# EAGLE design Alti (EAGLE 9.4.2)
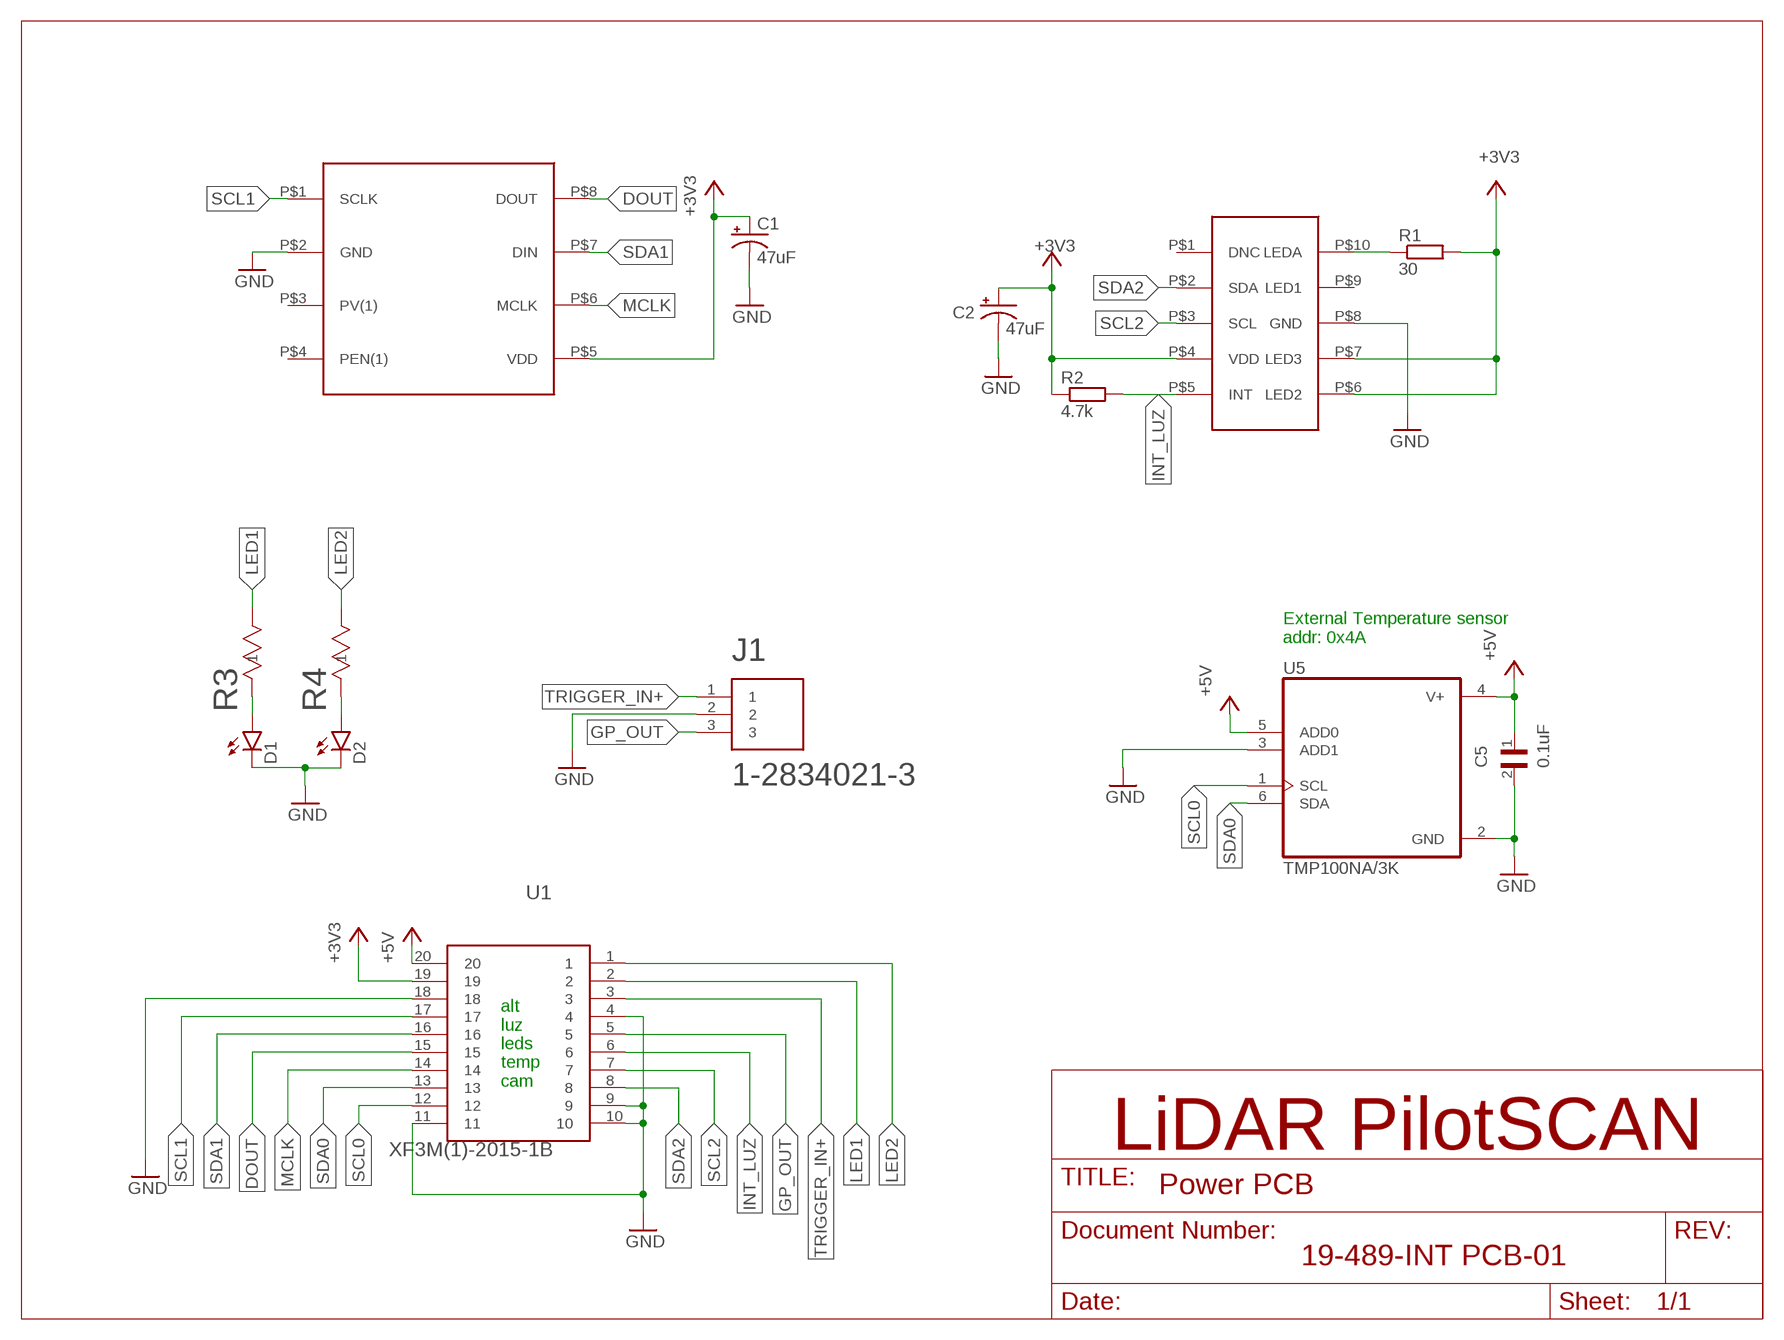
[diagram p0: schematic, sheet 1]

## Parts
C1  47uF  CL31A476MQHNNWE  [CL31A476MQHNNWE]
C2  47uF  CL31A476MQHNNWE  [CL31A476MQHNNWE]
C5  0.1uF  08056C104JAZ2A  [CAPC2012X140N]
D1  TLMS1000-GS08  [RESC1608X55]
D2  TLMS1000-GS08  [RESC1608X55]
J1  1-2834021-3  [CONN_1-2834021-3]
R1  30  R-EU_1812X7R  [1812X7R]
R2  4.7k  RMCF0805FT4K70  [RMCF0805FT4K70]
R3  RC0201JR-071K8L  [RES_RC0201_P6XP3]
R4  RC0201JR-071K8L  [RES_RC0201_P6XP3]
U1  XF3M(1)-2015-1B  [XF3M(1)-2015-1B]
U2  325540009-50  [325540009-50]
U3  SI1147-M01-GM  [SI1147-M01-GM]
U5  TMP100NA/3K  [TMP100NA/3K]

## Nets
+3V3: C1.2(+) C2.2(+) R1.2 R2.1 U1.19 U2.P$5(VDD) U3.P$4(VDD) U3.P$6(LED2) U3.P$7(LED3)
+5V [power]: C5.1 U1.20 U5.4(V+) U5.5(ADD0)
DOUT: U1.15 U2.P$8(DOUT)
GND: C1.1(-) C2.1(-) C5.2 D1.2(C) D2.2(C) J1.2 U1.4 U1.9 U1.10 U1.11 U1.18 U2.P$2(GND) U3.P$8(GND) U5.2(GND) U5.3(ADD1)
GP_OUT: J1.3 U1.5
INT_LUZ: R2.2 U1.6 U3.P$5(INT)
LED1: R3.2 U1.2
LED2: R4.2 U1.1
MCLK: U1.14 U2.P$6(MCLK)
N$1: D1.1(A) R3.1
N$2: D2.1(A) R4.1
N$10: R1.1 U3.P$10(LEDA)
SCL0: U1.12 U5.1(SCL)
SCL1: U1.17 U2.P$1(SCLK)
SCL2: U1.7 U3.P$3(SCL)
SDA0: U1.13 U5.6(SDA)
SDA1: U1.16 U2.P$7(DIN)
SDA2: U1.8 U3.P$2(SDA)
TRIGGER_IN+: J1.1 U1.3
Unconnected: U2.P$3(PV(1)) U2.P$4(PEN(1)) U3.P$1(DNC) U3.P$9(LED1)

## Notes on the sheet
- External Temperature sensor
  addr: 0x4A
- alt
  luz
  leds
  temp
  cam

## Library data of the parts
C1 C2 = CL31A476MQHNNWE:CL31A476MQHNNWE
C5 = 08056C104JAZ2A:08056C104JAZ2A: Cap Ceramic 0.1uF 6.3V X7R 5% SMD 0805 FlexiTerm 125°C T/R; AVAILABILITY: Unavailable; DESCRIPTION: 0805 100 nF 6.3 V ±5 % Tolerance X7R SMT Multilayer Ceramic Capacitor; MF: AVX; MP: 08056C104JAZ2A; PACKAGE: 0805 AVX; PRICE: None
D1 D2 = TLMS1000-GS08:TLMS1000-GS08: LED Uni-Color Red 640nm 2-Pin SMD T/R; DESCRIPTION: LED Uni-Color Red 640nm Automotive 2-Pin Chip 0603 T/R; DIGI-KEY_PART_NUMBER: TLMS1000-GS08CT-ND; DIGI-KEY_PURCHASE_URL: https://www.digikey.com.co/product-detail/en/vishay-semiconductor-opto-division/TLMS1000-GS08/TLMS1000-GS08CT-ND/4743829?utm_source=snapeda&utm_medium=aggregator&utm_campaign=symbol; MF: Vishay; MP: TLMS1000-GS08; PACKAGE: 0603 Vishay
J1 = 1-2834021-3:1-2834021-3: Conn PC Terminal Block RCP 3 POS 2.5mm Solder ST Thru-Hole 5A/Contact Box/Carton; COMMENT: 1-2834021-3; DESCRIPTION: Conn PC Terminal Block RCP 3 POS 2.5mm Solder ST Thru-Hole 5A/Contact Box/Carton; DIGI-KEY_PART_NUMBER: A123845-ND; DIGI-KEY_PURCHASE_URL: https://www.digikey.com/product-detail/en/te-connectivity-amp-connectors/1-2834021-3/A123845-ND/5872961?utm_source=snapeda&utm_medium=aggregator&utm_campaign=symbol; MF: TE Connectivity; MP: 1-2834021-3; PACKAGE: None; TE_PURCHASE_URL: https://www.te.com/usa-en/product-1-2834021-3.html?te_bu=Cor&te_type=disp&te_campaign=seda_glo_cor-seda-global-disp-prtnr-fy19-seda-model-bom-cta_sma-317_1&elqCampaignId=32493
R1 = resistor:R-EU_: RESISTOR, European symbol
R2 = RMCF0805FT4K70:RMCF0805FT4K70
R3 R4 = RES_SMD_1.8K_OHM_005W_0201:RC0201JR-071K8L; MANUFACTURER_PART_NUMBER: RC0201JR071K8L; VENDOR: Yageo
U1 = XF3M(1)-2015-1B:XF3M(1)-2015-1B: SOCKET FPC, SMT, 1MM, 14 WAY; AVAILABILITY: Unavailable; DESCRIPTION: 1.00mm FFC/FPC Connectors HSG ASSY ZIF SMT 14P; MF: Molex; MP: 52207-1485; PACKAGE: None; PRICE: None
U2 = 325540009-50:325540009-50
U3 = SI1147-M01-GM:SI1147-M01-GM
U5 = TMP100NA_3K:TMP100NA/3K: Digital Temperature Sensor with I2C Interface; AVAILABILITY: Unavailable; DESCRIPTION: Temperature Sensor with I2C/SMBus Interface in SOT-23 6-SOT-23 -55 to 125; MF: Texas Instruments; MP: TMP100NA/3K; PACKAGE: SOT-23 Texas Instruments; PRICE: None

## Net classes
0 default: clearance 0.205 mm
1 power: width 0.254 mm, clearance 0.205 mm to class 0, clearance 0.205 mm

## Board
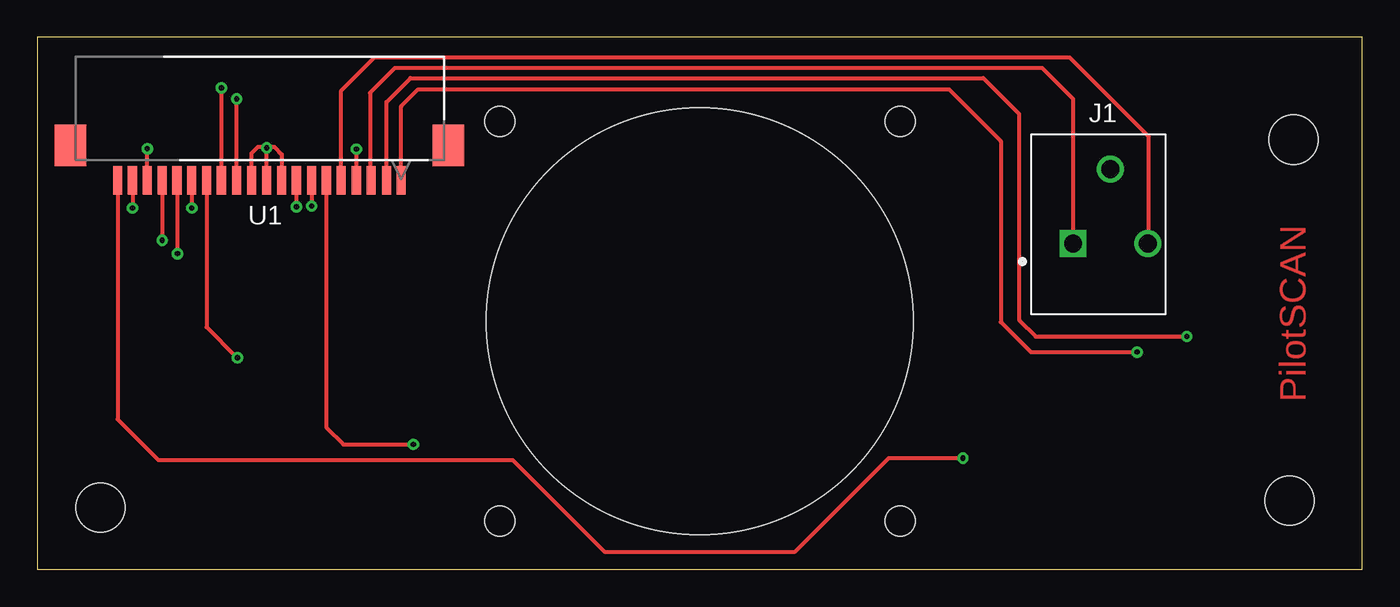
[diagram p1: board, top side]
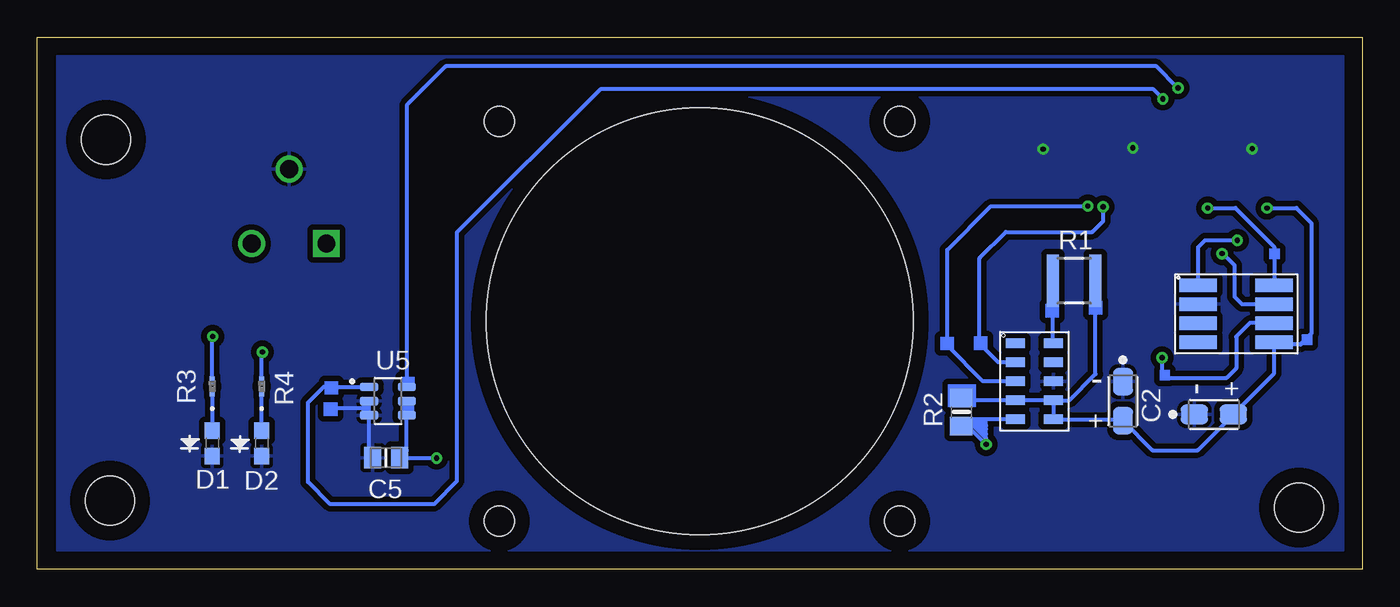
[diagram p2: board, bottom side, seen from below]

Size 88.49 x 35.56 mm. Coordinates in mm from the lower left corner, seen from the top.
Outline: 0,0 88.49,0 88.49,35.56 0,35.56 0,0
Copper layers (1*16): Top 0.035mm / dielectric 1.5mm / Bottom 0.035mm
Design rules "default": minimum track width 6mil, minimum drill 0.35mm, track to track 6mil, track to pad 6mil, pad to pad 6mil, via to via 6mil, smd to smd 6mil, copper to edge 40mil, drill to drill 6mil, minimum pad ring 10mil, minimum via ring 8mil, stop-mask expansion 4mil, vias tented up to drill 0mil, thermal gap 10mil
Holes 3.28 mm at 4.22,4.14 83.92,28.73 83.64,4.6
Holes 2.01 mm at 30.89,29.95 30.89,3.23 57.63,29.95 57.63,3.23
Holes 28.5 mm at 44.25,16.59

### Footprints (pad centres in the part's own frame; a part is rotated, then mirrored left to right if it is on the bottom)
CL31A476MQHNNWE = smd 1.81 x 1.32: 1 -1.3,0; 2 1.3,0
CAPC2012X140N = smd 1.15 x 1.45: 1 -0.9,0; 2 0.9,0
RESC1608X55 = smd 1.1 x 1: 1 -0.85,0; 2 0.85,0
CONN_1-2834021-3 = drill 1.2 square: 1 0,0 | drill 1.2: 2 2.5,5; 3 5,0
1812X7R = smd 0.8 x 3.5: 1 -1.425,0; 2 1.425,0
RMCF0805FT4K70 = smd 1.24 x 1.5: 1 -0.95,0; 2 0.95,0
RES_RC0201_P6XP3 = smd 0.559 x 0.33: 1 -0.394,0; 2 0.394,0
XF3M(1)-2015-1B = smd 0.61 x 1.905: 1 6.502,4.801; 2 5.512,4.801; 3 4.496,4.801; 4 3.505,4.801; 5 2.489,4.801; 6 1.499,4.801; 7 0.508,4.801; 8 -0.508,4.801; 9 -1.499,4.801; 10 -2.489,4.801; 11 -3.505,4.801; 12 -4.496,4.801; 13 -5.512,4.801; 14 -6.502,4.801; 15 -7.493,4.801; 16 -8.484,4.801; 17 -9.474,4.801; 18 -10.465,4.801; 19 -11.455,4.801; 20 -12.446,4.801 | smd 2.108 x 2.794: 21 -15.596,7.137; 22 9.652,7.137
325540009-50 = smd 2.5 x 0.9: P$1 -11.43,1.27; P$2 -11.43,0; P$3 -11.43,-1.27; P$4 -11.43,-2.54; P$5 -6.35,-2.54; P$6 -6.35,-1.27; P$7 -6.35,0; P$8 -6.35,1.27
SI1147-M01-GM = smd 1.27 x 0.635: P$1 -2.54,1.27; P$2 -2.54,0; P$3 -2.54,-1.27; P$4 -2.54,-2.54; P$5 -2.54,-3.81; P$6 0,-3.81; P$7 0,-2.54; P$8 0,-1.27; P$9 0,0; P$10 0,1.27
TMP100NA/3K = smd 1.21 x 0.58: 1 -1.255,0.95; 2 -1.255,0; 3 -1.255,-0.95; 4 1.255,-0.95; 5 1.255,0; 6 1.255,0.95

### Placement (x,y rotation side)
C1  9.91,10.36 0 bottom
C2  15.98,11.25 270 bottom
C5  65.2,7.47 180 bottom
D1  76.81,8.43 270 bottom
D2  73.51,8.43 270 bottom
J1  69.19,21.77 0 top
R1  19.23,19.3 0 bottom
R2  26.77,10.52 270 bottom
R3  76.81,12.24 90 bottom
R4  73.51,12.24 90 bottom
U1  17.81,21.21 0 top
U2  -0.48,17.73 0 bottom
U3  20.62,13.84 0 bottom
U5  65.07,11.25 0 bottom

### Tracks (layer width: path | path; a pad name or v marks a point on that pad's centre or on a via)
+3V3  (via drill 0.35)
  Top 0.254: U1.19 v6.35,24.16
  Bottom 0.254: 5.87,15.11 5.87,13.1 C1.2 8.61,10.34 10.98,7.97 13.99,7.97 C2.2 16.06,10.03 U3.P$6 U3.P$7 | 5.87,15.11 U2.P$5 | U3.P$7 U3.P$4 26.61,11.3 R2.1 | v6.35,24.16 4.39,24.16 3.38,23.14 3.38,15.77 4.12,15.04 5.79,15.04 5.87,15.11 | U3.P$7 19.56,11.3 17.8,13.06 R1.2
+5V  (via drill 0.35)
  Top 0.254: U1.20 5.36,10.04 8.08,7.32 31.75,7.32 37.87,1.19 50.62,1.19 56.87,7.44 v61.82,7.44 61.85,7.44
  Bottom 0.254: v61.82,7.44 61.85,7.47 C5.1 63.82,7.95 U5.4 U5.5
DOUT  (via drill 0.35)
  Top 0.254: U1.15 v10.31,24.16 10.31,24.13
  Bottom 0.254: v10.31,24.16 8.46,24.16 5.87,21.57 U2.P$8
GND  (via drill 0.35)
  Top 0.254: U1.18 v7.34,28.12 | U1.11 14.3,27.81 14.73,28.25 14.99,28.25 | 14.99,28.25 15.32,28.25 | 15.32,28.25 15.65,28.25 | 15.65,28.25 15.82,28.25 16.33,27.74 16.33,26.04 U1.9 | U1.10 15.32,27.91 | 15.32,27.91 v15.32,28.17 15.32,28.25 | 14.99,28.25 15.32,27.91 | 15.32,27.91 15.65,28.25 | U1.4 v21.31,28.09 21.31,28.17
  Bottom 0.254: C5.2 66.33,7.7 U5.3 | U5.3 U5.2 | U5.2 66.81,10.77 | U5.3 66.46,10.43 | 66.46,10.43 66.57,10.54 | 66.57,10.54 66.8,10.77 66.81,10.77 | U5.2 66.46,11.12 66.46,10.43 | U5.2 66.57,11.01 66.57,10.54 | 66.81,10.77 68.99,10.77
  pour Bottom (isolate 0.381): 1.24,34.29 1.24,1.27 87.17,1.27 87.17,34.29
GP_OUT
  Top 0.254: U1.5 20.3,32 22.52,34.23 68.95,34.23 74.22,28.96 74.22,21.8 J1.3
INT_LUZ  (via drill 0.35)
  Top 0.254: U1.6 19.3,9.5 20.45,8.36 v25.12,8.36
  Bottom 0.254: U3.P$5 25.07,10.03 | 25.07,10.03 25.53,10.03 | 25.53,10.03 25.78,10.03 | 25.78,10.03 26.11,10.03 | 26.11,10.03 26.23,10.03 26.42,9.84 | 25.12,9.63 25.12,9.98 25.07,10.03 | 25.12,8.76 v25.12,8.36 26.33,9.57 R2.2 26.5,9.84 26.42,9.84 | 25.12,8.76 25.12,9.04 | 25.12,9.04 25.12,9.37 | 25.12,9.37 25.12,9.63 | 25.12,9.63 25.53,10.03 | 25.12,9.37 25.78,10.03 | 25.12,9.04 26.11,10.03 | 25.12,8.76 26.2,9.84 26.42,9.84
LED1  (via drill 0.35)
  Top 0.254: U1.2 23.32,31.24 24.92,32.84 63.2,32.84 65.58,30.45 65.58,16.69 66.7,15.57 v76.78,15.57 76.81,15.57
  Bottom 0.254: R3.2 76.81,15.54 v76.78,15.57
LED2  (via drill 0.35)
  Top 0.254: U1.1 24.31,30.96 25.44,32.09 60.9,32.09 64.36,28.63 64.36,16.54 66.37,14.53 v73.46,14.53 73.51,14.58
  Bottom 0.254: R4.2 73.51,14.48 v73.46,14.53
MCLK  (via drill 0.35)
  Top 0.254: v13.36,14.15 11.3,16.2 U1.14
  Bottom 0.254: U2.P$6 5.89,16.48 7.49,16.48 8.41,15.57 8.41,13.44 9.04,12.8 12.95,12.8 13.36,13.21 v13.36,14.15
N$1
  Bottom 0.254: R3.1 D1.1
N$2
  Bottom 0.254: D2.1 R4.1
N$10
  Bottom 0.254: U3.P$10 20.65,15.14 R1.1
SCL0  (via drill 0.35)
  Top 0.254: U1.12 v13.31,31.45 13.31,31.6
  Bottom 0.254: v13.31,31.45 v13.31,31.46 13.95,32.09 50.89,32.09 60.48,22.5 60.48,5.89 62,4.37 68.94,4.37 70.41,5.84 70.41,11.15 69.36,12.2 U5.1
SCL1  (via drill 0.35)
  Top 0.254: U1.17 v8.33,22
  Bottom 0.254: U2.P$1 10.95,21.54 10.49,22 v8.33,22
SCL2  (via drill 0.35)
  Top 0.254: U1.7 v18.31,24.28 18.31,24.18
  Bottom 0.254: U3.P$3 25.32,12.57 27.71,14.96 27.71,21.36 24.79,24.28 v18.31,24.28
SDA0  (via drill 0.35)
  Top 0.254: U1.13 v12.29,32.18 12.29,32.21
  Bottom 0.254: v12.29,32.18 13.74,33.63 61.21,33.63 63.82,31.02 U5.6
SDA1  (via drill 0.35)
  Top 0.254: U1.16 9.35,25.98 v9.35,21.11
  Bottom 0.254: v9.35,21.11 9.3,21.11 8.53,20.34 8.53,18.24 8.03,17.73 U2.P$7
SDA2  (via drill 0.35)
  Top 0.254: U1.8 v17.3,24.23 17.3,24.18
  Bottom 0.254: U3.P$2 24.31,13.84 25.55,15.09 25.55,20.8 23.8,22.55 18.03,22.55 17.3,23.29 v17.3,24.23
TRIGGER_IN+
  Top 0.254: J1.1 69.19,31.45 67.13,33.5 23.88,33.5 22.23,31.85 22.23,26.09 U1.3
(copper drawn outside any net)
  shapes: Bottom area x12

### Text on the board
Top: PilotSCAN
bNames: - | - | + | +